# EAGLE design audio (EAGLE 9.6.2)

## Sheet 1 of 2
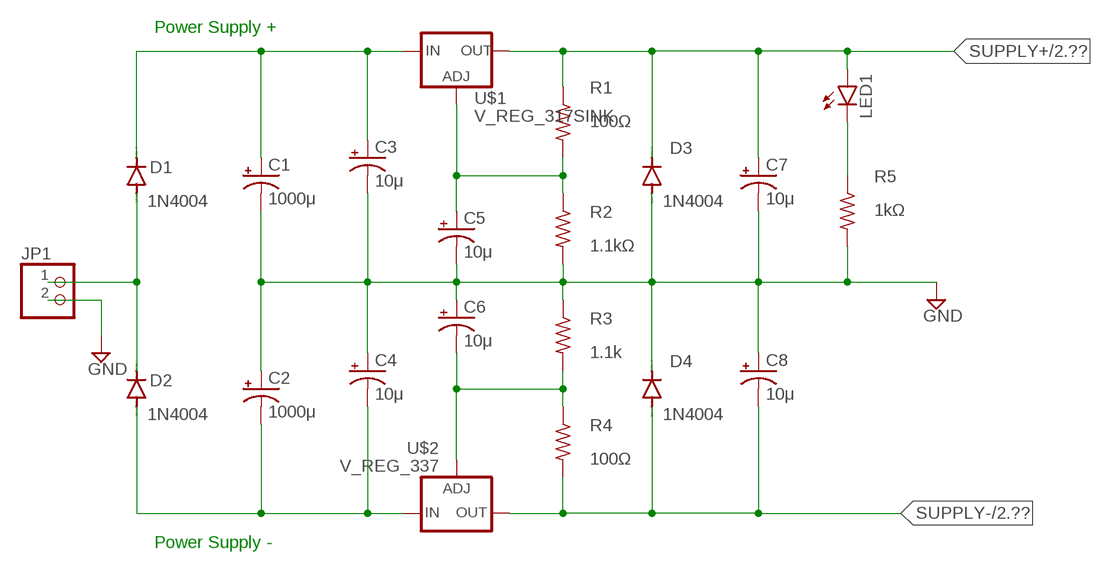
[diagram p0: schematic, sheet 1]

### Parts
C1  1000μ  CPOL-USE3.5-10  [E3,5-10]
C2  1000μ  CPOL-USE3.5-10  [E3,5-10]
C3  10μ  CPOL-USE1.8-4  [E1,8-4]
C4  10μ  CPOL-USE1.8-4  [E1,8-4]
C5  10μ  CPOL-USE1.8-4  [E1,8-4]
C6  10μ  CPOL-USE1.8-4  [E1,8-4]
C7  10μ  CPOL-USE1.8-4  [E1,8-4]
C8  10μ  CPOL-USE1.8-4  [E1,8-4]
D1  1N4004  [DO41-10]
D2  1N4004  [DO41-10]
D3  1N4004  [DO41-10]
D4  1N4004  [DO41-10]
JP1  PINHD-1X2  [1X02]
LED1  LED3MM  [LED3MM]
R1  100Ω  R-US_0204/7  [0204/7]
R2  1.1kΩ  R-US_0204/7  [0204/7]
R3  1.1k  R-US_0204/7  [0204/7]
R4  100Ω  R-US_0204/7  [0204/7]
R5  1kΩ  R-US_0204/7  [0204/7]
U$1  V_REG_317SINK  [TO220-ADJ]
U$2  V_REG_337  [TO220-ADJ-NEG]

### Nets
GND: C1.- C2.+ C3.- C4.+ C5.- C6.+ C7.- C8.+ D3.A D4.C JP1.2 R2.2 R3.1 R5.2 ; also sheet 2
N$1: C1.+ C3.+ D1.C U$1.IN
N$2: C2.- C4.- D2.A U$2.IN
N$3: D1.A D2.C JP1.1
N$4: C5.+ R1.2 R2.1 U$1.ADJ
N$5: C6.- R3.2 R4.1 U$2.ADJ
N$7: LED1.K(C) R5.1
SUPPLY+: C7.+ D3.C LED1.A R1.1 U$1.OUT ; also sheet 2
SUPPLY-: C8.- D4.A R4.2 U$2.OUT ; also sheet 2

### Notes on the sheet
- Power Supply +
- Power Supply -

## Sheet 2 of 2
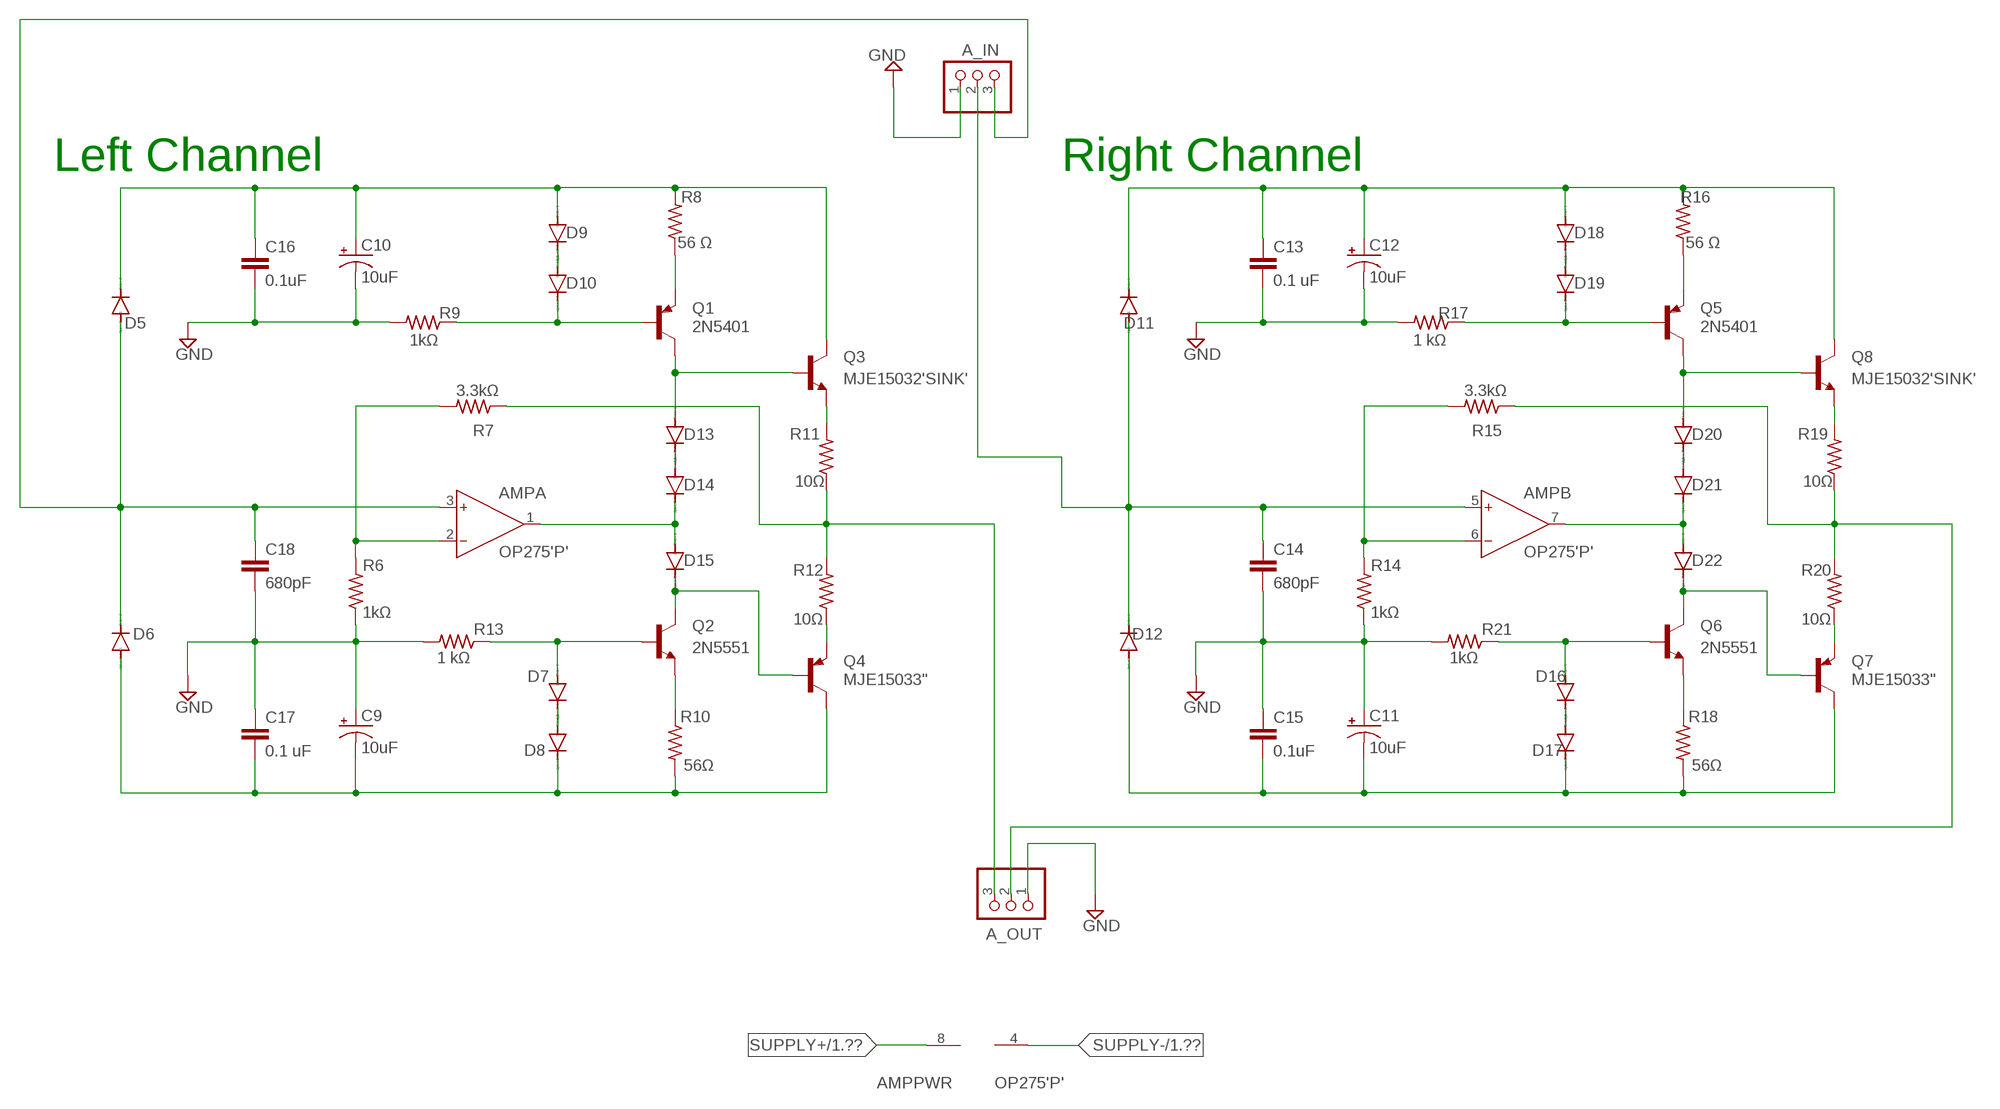
[diagram p1: schematic, sheet 2]

### Parts
A_IN  PINHD-1X3  [1X03]
A_OUT  PINHD-1X3  [1X03]
AMP  OP275'P'  [DIL08]
C9  10uF  CPOL-USE1.8-4  [E1,8-4]
C10  10uF  CPOL-USE1.8-4  [E1,8-4]
C11  10uF  CPOL-USE1.8-4  [E1,8-4]
C12  10uF  CPOL-USE1.8-4  [E1,8-4]
C13  0.1 uF  C2,5-3  [C2.5-3]
C14  680pF  C2,5-3  [C2.5-3]
C15  0.1uF  C2,5-3  [C2.5-3]
C16  0.1uF  C2,5-3  [C2.5-3]
C17  0.1 uF  C2,5-3  [C2.5-3]
C18  680pF  C2,5-3  [C2.5-3]
D5  1N4148DO35-7  [DO35-7]
D6  1N4148DO35-7  [DO35-7]
D7  1N4148DO35-7  [DO35-7]
D8  1N4148DO35-7  [DO35-7]
D9  1N4148DO35-7  [DO35-7]
D10  1N4148DO35-7  [DO35-7]
D11  1N4148DO35-7  [DO35-7]
D12  1N4148DO35-7  [DO35-7]
D13  1N4148DO35-7  [DO35-7]
D14  1N4148DO35-7  [DO35-7]
D15  1N4148DO35-7  [DO35-7]
D16  1N4148DO35-7  [DO35-7]
D17  1N4148DO35-7  [DO35-7]
D18  1N4148DO35-7  [DO35-7]
D19  1N4148DO35-7  [DO35-7]
D20  1N4148DO35-7  [DO35-7]
D21  1N4148DO35-7  [DO35-7]
D22  1N4148DO35-7  [DO35-7]
Q1  2N5401  [2N5401]
Q2  2N5551  [2N5551]
Q3  MJE15032'SINK'  [TO220V-SINK]
Q4  MJE15033"  [TO220V-SINK]
Q5  2N5401  [2N5401]
Q6  2N5551  [2N5551]
Q7  MJE15033"  [TO220V-SINK]
Q8  MJE15032'SINK'  [TO220V-SINK]
R6  1kΩ  R-US_0204/7  [0204/7]
R7  3.3kΩ  R-US_0204/7  [0204/7]
R8  56 Ω  R-US_0204/7  [0204/7]
R9  1kΩ  R-US_0204/7  [0204/7]
R10  56Ω  R-US_0204/7  [0204/7]
R11  10Ω  R-US_0204/7  [0204/7]
R12  10Ω  R-US_0204/7  [0204/7]
R13  1 kΩ  R-US_0204/7  [0204/7]
R14  1kΩ  R-US_0204/7  [0204/7]
R15  3.3kΩ  R-US_0204/7  [0204/7]
R16  56 Ω  R-US_0204/7  [0204/7]
R17  1 kΩ  R-US_0204/7  [0204/7]
R18  56Ω  R-US_0204/7  [0204/7]
R19  10Ω  R-US_0204/7  [0204/7]
R20  10Ω  R-US_0204/7  [0204/7]
R21  1kΩ  R-US_0204/7  [0204/7]

### Nets
GND: A_IN.1 A_OUT.1 C9.+ C10.- C11.+ C12.- C13.2 C14.2 C15.1 C16.2 C17.1 C18.2 R6.1 R9.2 R13.2 R14.1 R17.2 R21.2 ; also sheet 1
N$6: A_IN.3 AMP.3(A:IN+) C18.1 D5.A D6.C
N$8: C9.- C17.2 D6.A D8.C Q4.2(C) R10.2
N$9: D7.C D8.A
N$10: C10.+ C16.1 D5.C D9.A Q3.2(C) R8.2
N$11: D9.C D10.A
N$12: AMP.2(A:IN-) R6.2 R7.2
N$13: Q1.E R8.1
N$14: D13.C D14.A
N$15: D13.A Q1.C Q3.1(B)
N$16: AMP.1(A:OUT) D14.C D15.A
N$17: D15.C Q2.C Q4.1(B)
N$18: Q2.E R10.1
N$19: D10.C Q1.B R9.1
N$20: Q3.3(E) R11.2
N$21: Q4.3(E) R12.1
N$22: D7.A Q2.B R13.1
N$23: A_OUT.3 R7.1 R11.1 R12.2
N$24: A_IN.2 AMP.5(B:IN+) C14.1 D11.A D12.C
N$25: C11.- C15.2 D12.A D17.C Q7.2(C) R18.2
N$26: D16.C D17.A
N$27: C12.+ C13.1 D11.C D18.A Q8.2(C) R16.2
N$28: D18.C D19.A
N$29: AMP.6(B:IN-) R14.2 R15.2
N$30: Q5.E R16.1
N$31: D20.C D21.A
N$32: D20.A Q5.C Q8.1(B)
N$33: AMP.7(B:OUT) D21.C D22.A
N$34: D22.C Q6.C Q7.1(B)
N$35: D19.C Q5.B R17.1
N$36: Q6.E R18.1
N$37: Q8.3(E) R19.2
N$38: Q7.3(E) R20.1
N$39: D16.A Q6.B R21.1
N$40: A_OUT.2 R15.1 R19.1 R20.2
SUPPLY+: AMP.8(PWR:V+) ; also sheet 1
SUPPLY-: AMP.4(PWR:V-) ; also sheet 1

### Notes on the sheet
- Left Channel | Right Channel

## Library data of the parts
A_IN A_OUT = pinhead:PINHD-1X3: PIN HEADER
AMP = engr301_Library:OP275: OP275 - Dual Bipolar/JFET Audio Op-amp
C1-C12 = rcl:CPOL-US: POLARIZED CAPACITOR, American symbol; SPICEPREFIX: C
C13-C18 = capacitor-wima:C: CAPACITOR naming: grid - package width
D1-D4 = diode:1N4004: DIODE general purpose rectifier, 1 A
D5-D22 = diode:1N4148: DIODE high speed (Philips)
JP1 = pinhead:PINHD-1X2: PIN HEADER
LED1 = led:LED: LED OSRAM: - CHIPLED LG R971, LG N971, LY N971, LG Q971, LY Q971, LO R971, LY R971 LH N974, LH R974 LS Q976, LO Q976, LY Q976 LO Q996 - Hyper CHIPLED LW Q18S LB Q993, LB Q99A, LB R99A - SideLED LS A670, LO A670, LY A670, LG A670, LP A670 LB A673, LV A673, LT A673, LW A673 LH A674 LY A675 LS A676, LA A676, LO A676, LY A676, LW A676 LS A679, LY A679, LG A679 - Hyper Micro SIDELED® LS Y876, LA Y876, LO Y876, LY Y876 LT Y87S - SmartLED LW L88C, LW L88S LB L89C, LB L89S, LG L890 LS L89K, LO L89K, LY L89K LS L896, LA L896, LO L896, LY L896 - TOPLED LS T670, LO T670, LY T670, LG T670, LP T670 LSG T670, LSP T670, LSY T670, LOP T670, LYG T670 LG T671, LOG T671, LSG T671 LB T673, LV T673, LT T673, LW T673 LH T674 LS T676, LA T676, LO T676, LY T676, LB T676, LH T676, LSB T676, LW T676 LB T67C, LV T67C, LT T67C, LS T67K, LO T67K, LY T67K, LW E67C LS E67B, LA E67B, LO E67B, LY E67B, LB E67C, LV E67C, LT E67C LW T67C LS T679, LY T679, LG T679 LS T770, LO T770, LY T770, LG T770, LP T770 LB T773, LV T773, LT T773, LW T773 LH T774 LS E675, LA E675, LY E675, LS T675 LS T776, LA T776, LO T776, LY T776, LB T776 LHGB T686 LT T68C, LB T68C - Hyper Mini TOPLED® LB M676 - Mini TOPLED Santana® LG M470 LS M47K, LO M47K, LY M47K Source: http://www.osram.convergy.de LUXEON: - LUMILED® LXK2-PW12-R00, LXK2-PW12-S00, LXK2-PW14-U00, LXK2-PW14-V00 LXK2-PM12-R00, LXK2-PM12-S00, LXK2-PM14-U00 LXK2-PE12-Q00, LXK2-PE12-R00, LXK2-PE12-S00, LXK2-PE14-T00, LXK2-PE14-U00 LXK2-PB12-K00, LXK2-PB12-L00, LXK2-PB12-M00, LXK2-PB14-N00, LXK2-PB14-P00, LXK2-PB14-Q00 LXK2-PR12-L00, LXK2-PR12-M00, LXK2-PR14-Q00, LXK2-PR14-R00 LXK2-PD12-Q00, LXK2-PD12-R00, LXK2-PD12-S00 LXK2-PH12-R00, LXK2-PH12-S00 LXK2-PL12-P00, LXK2-PL12-Q00, LXK2-PL12-R00 Source: www.luxeon.com KINGBRIGHT: KA-3528ASYC Source: www.kingbright.com
Q1 Q5 = engr301_Library:2N5401: PNP Amplifier Transistors
Q2 Q6 = engr301_Library:2N5551: NPN Amplifier Transistors
Q3 Q8 = engr301_Library:MJE15032: NPN Power Transistor HF Audio Driver 8.0A, 250V, 50W
Q4 Q7 = engr301_Library:MJE15033: PNP Power Transistor HF Audio Driver 8.0A, 250V, 50W
R1-R21 = rcl:R-US_: RESISTOR, American symbol; SPICEPREFIX: R
U$1 = engr301_Library:V_REG_317: Voltage Regulator Standard LM317 adjustable voltage regulator. AOI (Adjust Output Input). Google 'LM317 Calculator' for easy to use app to get the two resistor values needed. 240/720 for 5V output. 240/390 for 3.3V output. Spark Fun Electronics SKU : COM-00527
U$2 = engr301_Library:V_REG_337: LM-337 Negative Adjustable Voltage Regulator

## Board
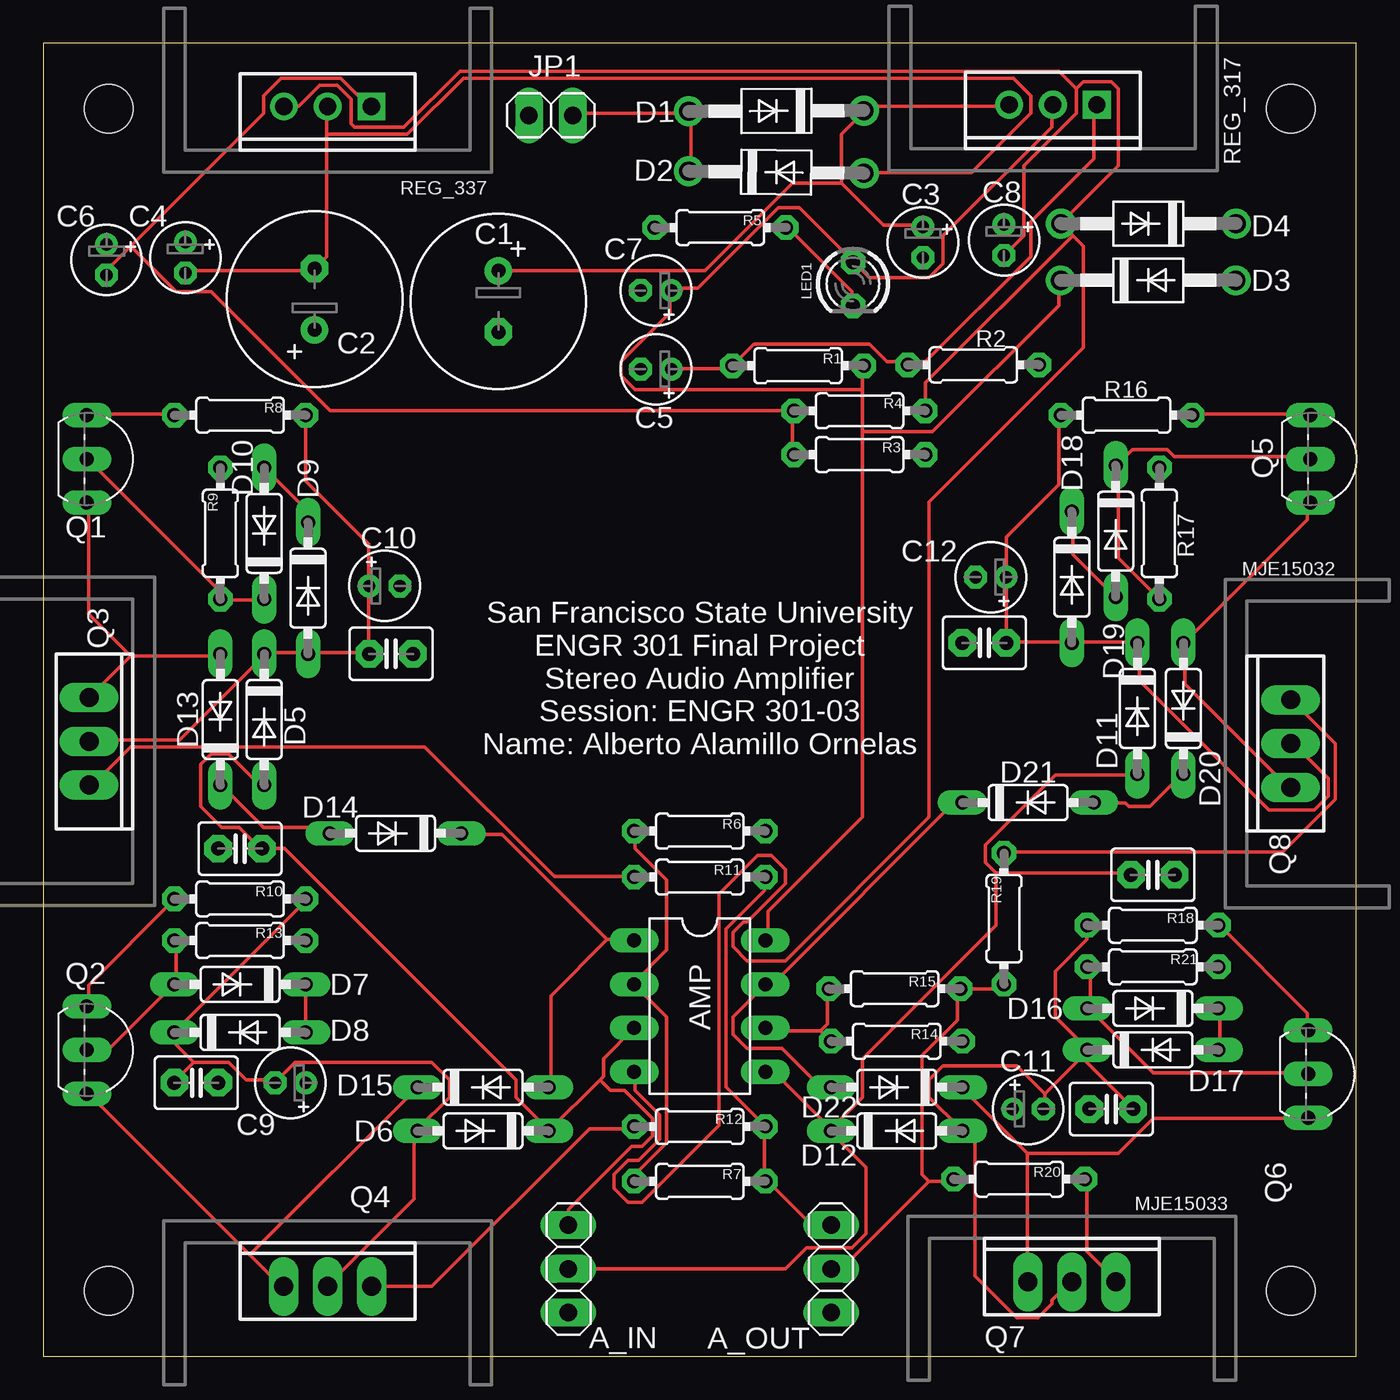
[diagram p2: board, top side]
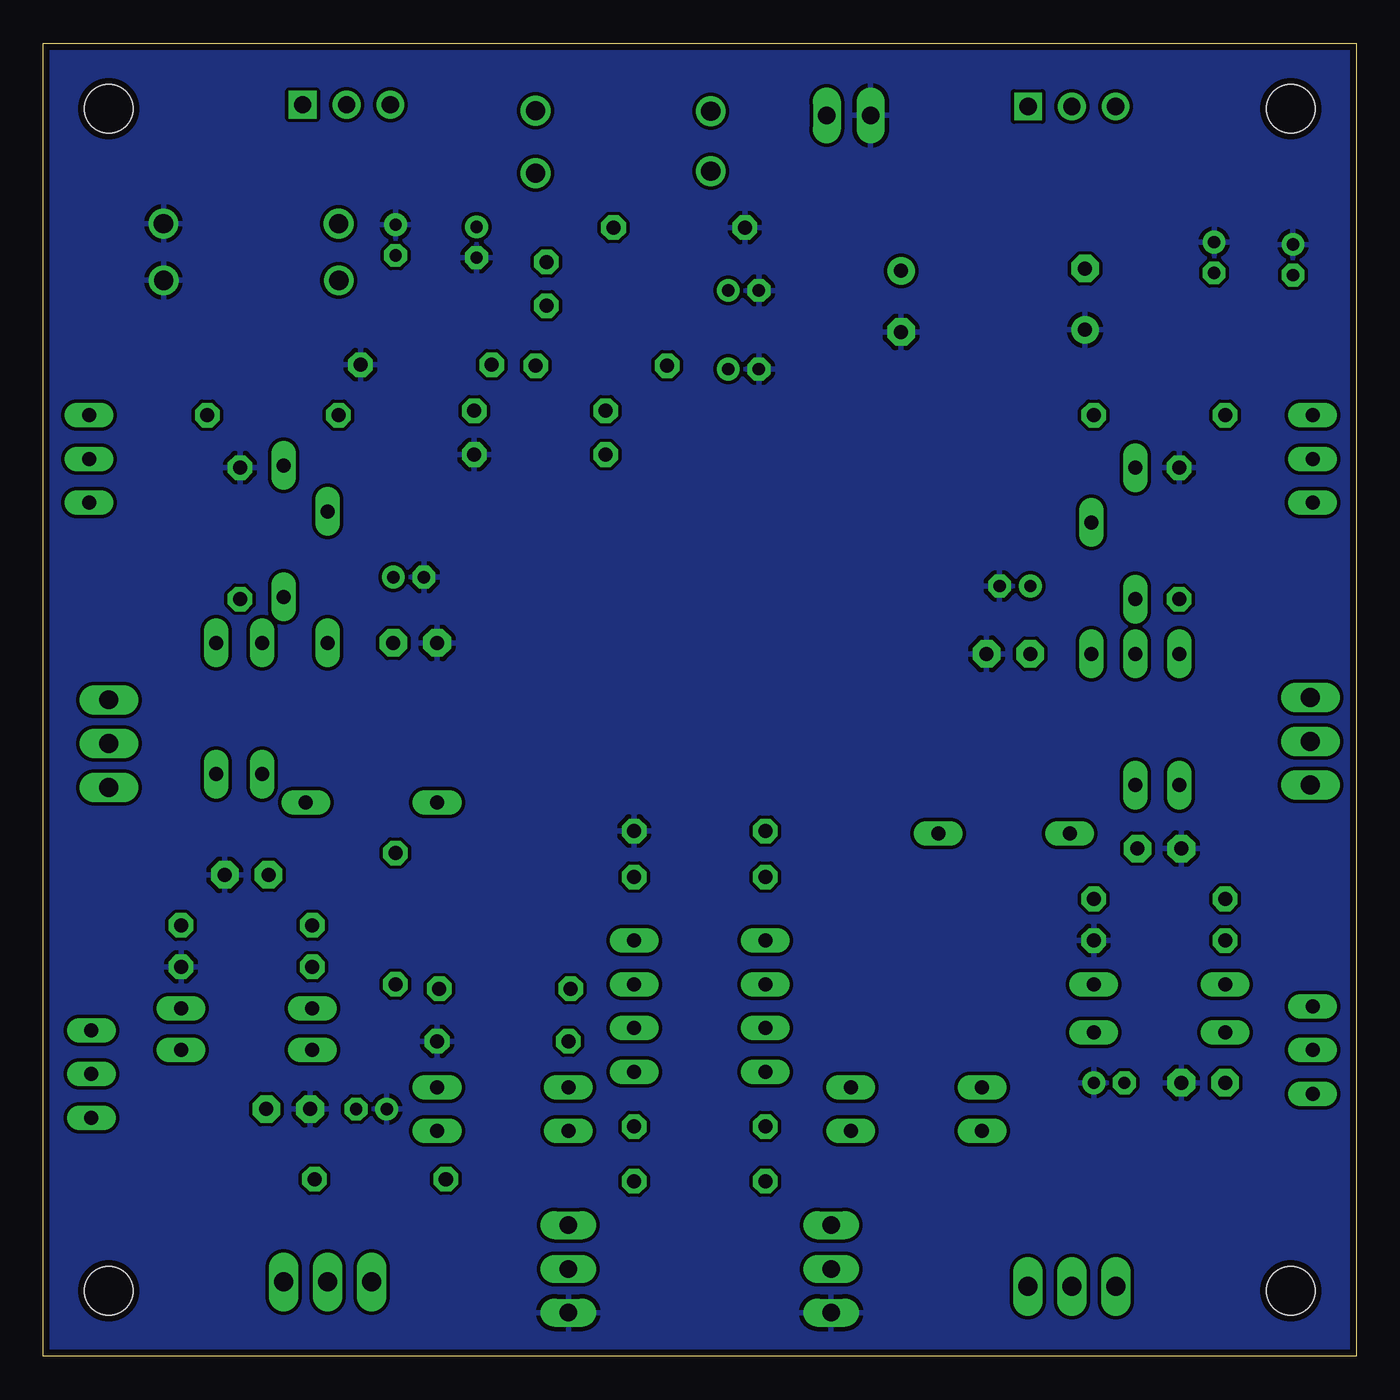
[diagram p3: board, bottom side, seen from below]

Size 76.2 x 76.2 mm. Coordinates in mm from the lower left corner, seen from the top.
Outline: 0,0 76.2,0 76.2,76.2 0,76.2 0,0
Copper layers (1*16): Top 0.035mm / dielectric 1.5mm / Bottom 0.035mm
Design rules "engr301_DesignRule": minimum track width 8mil, minimum drill 20mil, track to track 8mil, track to pad 10mil, pad to pad 10mil, via to via 10mil, smd to smd 8mil, copper to edge 15mil, drill to drill 8mil, minimum pad ring 12mil, minimum via ring 10mil, stop-mask expansion 4mil, vias tented up to drill 25mil, thermal gap 10mil
Holes 2.8 mm at 3.81,3.81 72.39,3.81 72.39,72.39 3.81,72.39

### Footprints (pad centres in the part's own frame; a part is rotated, then mirrored left to right if it is on the bottom)
1X03 = drill 1.016 long: 1 -2.54,0; 2 0,0; 3 2.54,0
DIL08 = drill 0.813 long: 1 -3.81,-3.81; 2 -1.27,-3.81; 3 1.27,-3.81; 4 3.81,-3.81; 5 3.81,3.81; 6 1.27,3.81; 7 -1.27,3.81; 8 -3.81,3.81
E3,5-10 = drill 0.813 pad 1.6: + -1.778,0 | drill 0.813 pad 1.6 octagon: - 1.778,0
E1,8-4 = drill 0.711 pad 1.168: + -0.889,0 | drill 0.711 pad 1.168 octagon: - 0.889,0
C2.5-3 = drill 0.813 pad 1.6 octagon: 1 -1.27,0; 2 1.27,0
DO41-10 = drill 1.118: A 5.08,0; C -5.08,0
DO35-7 = drill 0.813 long: A 3.81,0; C -3.81,0
1X02 = drill 1.016 long: 1 -1.27,0; 2 1.27,0
LED3MM = drill 0.813 octagon: A -1.27,0; K 1.27,0
2N5401 = drill 0.813 long: B 0,0; C 2.54,0; E -2.54,0
2N5551 = drill 0.813 long: B 0,0; C 2.54,0; E -2.54,0
TO220V-SINK = drill 1.1 long: 1 -2.54,-1.27; 2 0,-1.27; 3 2.54,-1.27
0204/7 = drill 0.813 octagon: 1 -3.81,0; 2 3.81,0
TO220-ADJ = drill 1 square: ADJ -2.54,0 | drill 1: IN 2.54,0; OUT 0,0
TO220-ADJ-NEG = drill 1 square: ADJ -2.54,0 | drill 1: IN 0,0; OUT 2.54,0

### Placement (x,y rotation side)
A_IN  30.48,5.08 90 top
A_OUT  45.72,5.08 90 top
AMP  38.1,20.32 270 top
C1  26.42,61.21 270 top
C2  15.75,61.34 90 top
C3  51.05,64.64 270 top
C4  8.26,63.75 270 top
C5  35.56,57.28 180 top
C6  3.68,63.63 270 top
C7  35.56,61.85 180 top
C8  55.75,64.77 270 top
C9  14.35,15.88 180 top
C10  19.81,44.7 0 top
C11  57.15,14.35 0 top
C12  54.99,45.21 180 top
C13  54.61,41.4 180 top
C14  64.39,27.94 0 top
C15  61.98,14.35 0 top
C16  20.19,40.77 0 top
C17  8.89,15.88 180 top
C18  11.43,29.46 180 top
D1  42.55,72.26 180.2 top
D2  42.55,68.71 359.3 top
D3  64.12,62.44 0 top
D4  64.13,65.73 180 top
D5  12.83,36.96 270 top
D6  25.53,13.08 180 top
D7  11.43,21.59 180 top
D8  11.43,18.8 0 top
D9  15.37,44.58 270 top
D10  12.83,47.75 90 top
D11  63.5,37.59 270 top
D12  49.53,13.08 0 top
D13  10.29,36.96 90 top
D14  20.45,30.35 180 top
D15  25.53,15.62 0 top
D16  64.39,20.19 180 top
D17  64.39,17.78 0 top
D18  59.69,45.21 270 top
D19  62.23,47.88 270 top
D20  66.17,37.59 90 top
D21  57.15,32.13 0 top
D22  49.53,15.62 180 top
JP1  29.46,72.01 180 top
LED1  46.99,62.23 270 top
Q1  2.54,52.07 270 top
Q2  2.54,17.78 270 top
Q3  3.94,35.69 270 top
Q4  16.51,5.33 0 top
Q5  73.53,52.07 270 top
Q6  73.41,16.38 270 top
Q7  59.69,5.59 0 top
Q8  71.12,35.56 90 top
R1  43.8,57.48 180 top
R2  53.98,57.53 0 top
R3  47.37,52.32 180 top
R4  47.37,54.86 0 top
R5  39.29,65.5 180 top
R6  38.1,30.48 180 top
R7  38.1,10.16 180 top
R8  11.43,54.61 0 top
R9  10.29,47.75 90 top
R10  11.43,26.54 0 top
R11  38.1,27.81 180 top
R12  38.1,13.34 0 top
R13  11.43,24.13 0 top
R14  49.53,18.29 180 top
R15  49.4,21.34 180 top
R16  62.87,54.61 180 top
R17  64.77,47.75 90 top
R18  64.39,25.02 180 top
R19  55.75,25.4 90 top
R20  56.64,10.29 180 top
R21  64.39,22.61 0 top
U$1  58.59,72.62 180 top
U$2  16.51,72.52 180 top

### Tracks (layer width: path | path; a pad name or v marks a point on that pad's centre or on a via)
GND
  pour Bottom (isolate 0.305): -1.27,77.47 77.47,77.47 77.47,-1.27 -1.27,-1.27
  pour Bottom: -3.81,77.47 77.47,77.47 82.55,72.39 82.55,1.27 76.2,-5.08 -5.08,-5.08 -6.35,-3.81 -6.35,74.93
  pour Bottom: -3.81,77.47 77.47,77.47 82.55,72.39 82.55,1.27 76.2,-5.08 -5.08,-5.08 -6.35,-3.81 -6.35,74.93
N$1
  Top 0.203: 46.33,68.07 48.77,65.63 51,65.63 C3.+ | 46.33,68.07 46.33,70.92 47.55,72.14 D1.C 47.75,72.34 47.95,72.54 55.88,72.54 U$1.IN | C1.+ 38.41,62.99 43.48,68.07 46.33,68.07
N$2
  Top 0.203: C4.- 8.33,62.99 15.65,62.99 C2.- 15.85,63.2 16.46,63.8 16.46,70.92 | 16.46,70.92 16.46,72.34 U$2.IN | 16.46,70.92 21.13,70.92 24.38,74.17 56.29,74.17 57.3,73.15 57.3,72.14 53.85,68.68 47.75,68.68 D2.A
N$3
  Top 0.203: JP1.1 30.89,72.14 37.39,72.14 D1.A 37.59,72.14 37.59,68.89 D2.C
N$4
  Top 0.203: C5.+ 36.58,57.3 39.83,57.3 R1.2 40.03,57.51 41.25,58.73 47.95,58.73 48.97,57.71 49.99,57.71 R2.1 50.19,57.71 51.21,57.71 57.3,63.8 57.3,65.84 60.96,69.49 60.96,72.54 U$1.ADJ
N$5
  Top 0.203: 43.48,54.86 43.48,52.43 R3.2 | 5.08,64.41 12.8,72.14 12.8,73.15 13.82,74.17 17.27,74.17 18.9,72.54 U$2.ADJ | 5.08,64.41 3.86,63.2 3.86,62.79 C6.- | 43.48,54.86 16.66,54.86 9.75,61.77 7.72,61.77 5.08,64.41 | 43.48,54.86 R4.1
N$6
  Top 0.203: D5.A 12.8,33.33 12.39,33.33 10.77,34.95 9.75,34.95 9.14,34.34 9.14,31.9 10.36,30.68 11.38,30.68 12.6,29.46 C18.1 14.02,29.46 27.43,16.05 27.43,15.04 29.26,13.21 D6.C 32.31,16.05 | 32.31,16.05 32.51,16.26 32.51,17.27 AMP.3 | A_IN.3 30.48,8.53 34.14,12.19 34.75,12.19 35.36,12.8 35.36,13.82 33.73,15.44 32.92,15.44 32.31,16.05
N$7
  Top 0.203: LED1.K 46.94,60.96 46.94,61.77 43.28,65.43 R5.1
N$8
  Top 0.203: Q4.2 16.46,4.06 21.54,9.14 21.54,13.01 D6.A 21.74,13.21 23.57,15.04 23.57,16.05 22.55,17.07 14.63,17.07 13.61,16.05 C9.- 13.41,16.05 11.79,16.05 10.77,17.07 8.74,17.07 | 8.74,17.07 7.72,16.05 C17.2 | 8.74,17.07 7.72,18.09 7.72,18.69 D8.C 15.24,26.42 R10.2
N$9
  Top 0.203: D7.C D8.A
N$10
  Top 0.203: 18.9,40.84 18.9,44.7 | R8.2 15.24,50.8 18.9,47.14 18.9,44.7 | 18.9,44.7 C10.+ | Q3.2 2.85,35.76 7.92,35.76 12.8,40.64 D5.C 13.01,40.84 15.24,40.84 D9.A 15.44,40.84 18.9,40.84 | 18.9,40.84 C16.1
N$11
  Top 0.203: D9.C 15.24,48.56 15.24,49.17 13.01,51.41 D10.A
N$12
  Top 0.203: R7.2 34.34,10.16 34.34,10.57 36.17,12.39 36.17,19.71 AMP.2 34.34,21.74 36.17,23.57 36.17,27.64 34.34,29.46 34.34,30.48 R6.2
N$13
  Top 0.203: Q1.E 2.64,54.66 7.52,54.66 R8.1
N$14
  Top 0.203: D13.C 10.36,33.12 12.8,30.68 16.26,30.68 16.46,30.48 D14.A
N$15
  Top 0.203: 5.08,40.64 10.16,40.64 D13.A | Q3.1 5.08,40.64 | 5.08,40.64 2.64,43.08 2.64,49.38 Q1.C
N$16
  Top 0.203: 32.72,24.18 26.62,30.28 24.38,30.28 D14.C | 32.72,24.18 34.14,24.18 AMP.1 | 32.72,24.18 29.46,20.93 29.46,15.65 D15.A
N$17
  Top 0.203: 11.99,5.89 13.82,4.06 Q4.1 | 11.99,5.89 2.64,15.24 Q2.C | 11.99,5.89 D15.C
N$18
  Top 0.203: Q2.E 2.64,20.32 2.64,21.54 7.52,26.42 R10.1
N$19
  Top 0.203: Q1.B 2.64,52.02 10.16,44.5 10.16,44.09 R9.1 10.36,43.89 12.8,43.89 D10.C
N$20
  Top 0.203: R11.2 34.14,27.84 29.67,27.84 22.15,35.36 5.08,35.36 2.85,33.12 Q3.3
N$21
  Top 0.203: Q4.3 22.55,4.06 31.7,13.21 34.14,13.21 R12.1
N$22
  Top 0.203: Q2.B 2.64,17.88 3.86,17.88 7.52,21.54 D7.A 7.72,21.74 7.72,23.98 R13.1
N$23
  Top 0.203: R11.1 41.86,27.64 41.86,27.03 39.62,24.79 39.62,15.65 41.86,13.41 R12.2 41.86,13.21 41.86,10.16 R7.1 42.06,10.16 44.5,7.72 45.72,7.72 A_OUT.3
N$24
  Top 0.203: 55.27,28.04 54.66,28.65 54.66,29.67 58.73,33.73 63.4,33.73 D11.A | 55.27,28.04 62.99,28.04 C14.1 | 45.72,13.21 42.47,16.46 42.06,16.46 AMP.5 | A_IN.2 43.08,5.08 44.3,6.3 46.94,6.3 47.75,7.11 47.75,10.97 45.72,13.01 D12.C 45.72,13.21 | 55.27,28.04 55.27,24.99 47.55,17.27 47.55,15.04 45.72,13.21
N$25
  Top 0.203: 58.12,15.24 58.12,14.43 C11.- | 60.15,17.27 60.55,17.68 D17.C | 60.15,17.27 58.12,15.24 | 58.12,15.24 56.49,16.87 52.22,16.87 51.41,16.05 51.41,15.04 53.24,13.21 D12.A 53.44,13.01 54.05,12.39 54.05,4.67 56.49,2.23 57.71,2.23 58.52,3.05 58.52,3.25 59.54,4.27 Q7.2 | R18.2 60.55,24.99 60.55,24.18 58.73,22.35 58.73,19.71 60.55,17.88 D17.C | 60.15,17.27 60.35,17.27 63.2,14.43 C15.2 | 60.15,17.27 D17.C
N$26
  Top 0.203: D17.A 68.28,17.88 68.28,20.12 D16.C
N$27
  Top 0.203: 55.88,41.45 C12.+ 55.88,47.55 58.93,50.6 58.93,54.46 R16.2 | Q8.2 72.54,35.56 74.57,33.53 74.57,32.51 73.76,31.7 71.12,31.7 63.6,39.22 63.6,41.25 D11.C 63.4,41.45 59.74,41.45 D18.A 59.54,41.45 55.88,41.45 | 55.88,41.45 C13.1
N$28
  Top 0.203: D18.C 59.74,48.97 59.74,46.53 62.18,44.09 D19.A
N$29
  Top 0.203: 45.11,18.9 42.06,18.9 AMP.6 | R14.2 45.11,18.9 | 45.11,18.9 45.52,19.3 45.52,21.34 R15.2
N$30
  Top 0.203: R16.1 66.85,54.66 73.36,54.66 Q5.E
N$31
  Top 0.203: D21.A 60.96,32.11 62.79,32.11 62.99,31.9 64.21,31.9 66.04,33.73 D20.C
N$32
  Top 0.203: Q8.1 72.34,32.92 66.24,39.01 66.24,41.25 D20.A 66.24,41.45 73.36,48.56 73.36,49.38 Q5.C
N$33
  Top 0.203: D22.A 45.72,15.65 45.11,15.65 42.88,17.88 40.84,17.88 40.03,18.69 40.03,19.71 AMP.7 42.06,21.74 42.47,21.74 52.83,32.11 53.24,32.11 D21.C
N$34
  Top 0.203: 57.1,11.79 53.44,15.44 D22.C | 57.1,11.79 57.1,4.47 Q7.1 | 57.1,11.79 62.38,11.79 64.41,13.82 73.36,13.82 Q6.C
N$35
  Top 0.203: R17.1 62.38,46.33 62.38,51.61 D19.C 62.38,51.82 63.2,52.63 65.23,52.63 65.63,52.22 73.36,52.22 Q5.B
N$36
  Top 0.203: Q6.E 73.36,19.1 73.36,19.91 68.28,24.99 R18.1
N$37
  Top 0.203: R19.2 55.88,29.26 71.93,29.26 74.98,32.31 74.98,35.56 72.54,38 Q8.3
N$38
  Top 0.203: R20.1 60.55,10.16 60.55,6.1 62.18,4.47 Q7.3
N$39
  Top 0.203: R21.1 60.76,22.55 60.76,20.32 D16.A 60.76,20.12 64.41,16.46 73.36,16.46 Q6.B
N$40
  Top 0.203: R19.1 55.68,21.54 55.47,21.34 R15.1 53.03,21.34 53.03,19.51 51,17.48 51,10.57 51.41,10.16 | 51.41,10.16 52.83,10.16 R20.2 | 51.41,10.16 46.33,5.08 A_OUT.2
SUPPLY+
  Top 0.203: U$1.OUT 58.52,72.54 58.52,71.32 52.22,65.02 52.22,63.4 51.41,62.59 47.95,62.59 47.14,63.4 LED1.A 46.94,63.6 43.89,66.65 42.67,66.65 38,61.98 36.58,61.98 C7.+ 36.37,61.77 36.37,60.55 33.53,57.71 33.53,56.9 34.34,56.08 47.55,56.08 | 47.55,56.08 47.55,57.3 R1.1 | 47.55,56.08 47.55,53.65 | 47.55,53.65 47.55,31.29 42.06,25.81 42.06,24.18 AMP.8 | 47.55,53.65 51.61,53.65 58.93,60.96 58.93,62.38 D3.C
SUPPLY-
  Top 0.203: C8.- 56.9,65.02 56.9,69.09 59.94,72.14 59.94,73.56 | 59.94,73.56 60.35,73.97 61.98,73.97 62.38,73.56 62.38,69.09 59.13,65.84 D4.A 59.13,65.63 59.74,65.02 | 59.74,65.02 60.35,64.41 60.35,58.52 51.41,49.58 51.41,31.29 43.08,22.96 40.84,22.96 40.03,23.77 40.03,24.59 40.64,25.2 40.84,25.2 43.08,27.43 43.08,28.25 42.27,29.06 41.45,29.06 39.22,26.82 39.22,13.41 34.75,8.94 33.93,8.94 33.12,9.75 33.12,10.57 33.93,11.38 34.54,11.38 35.76,12.6 35.76,14.02 34.34,15.44 34.34,16.46 AMP.4 | 59.74,65.02 51.21,56.49 51.21,54.86 R4.2 | 59.94,73.56 58.93,74.57 24.18,74.57 20.93,71.32 18.09,71.32 17.88,71.53 17.88,72.95 17.07,73.76 16.05,73.76 14.83,72.54 14.02,72.54 U$2.OUT

### Text on the board
tPlace: San Francisco State University / ENGR 301 Final Project / Stereo Audio Amplifier / Session: ENGR 301-03 / Name: Alberto Alamillo Ornelas
tNames: REG_317 | REG_337 | MJE15032 | MJE15033